# Altium project PCB_FinalProject.PrjPcb
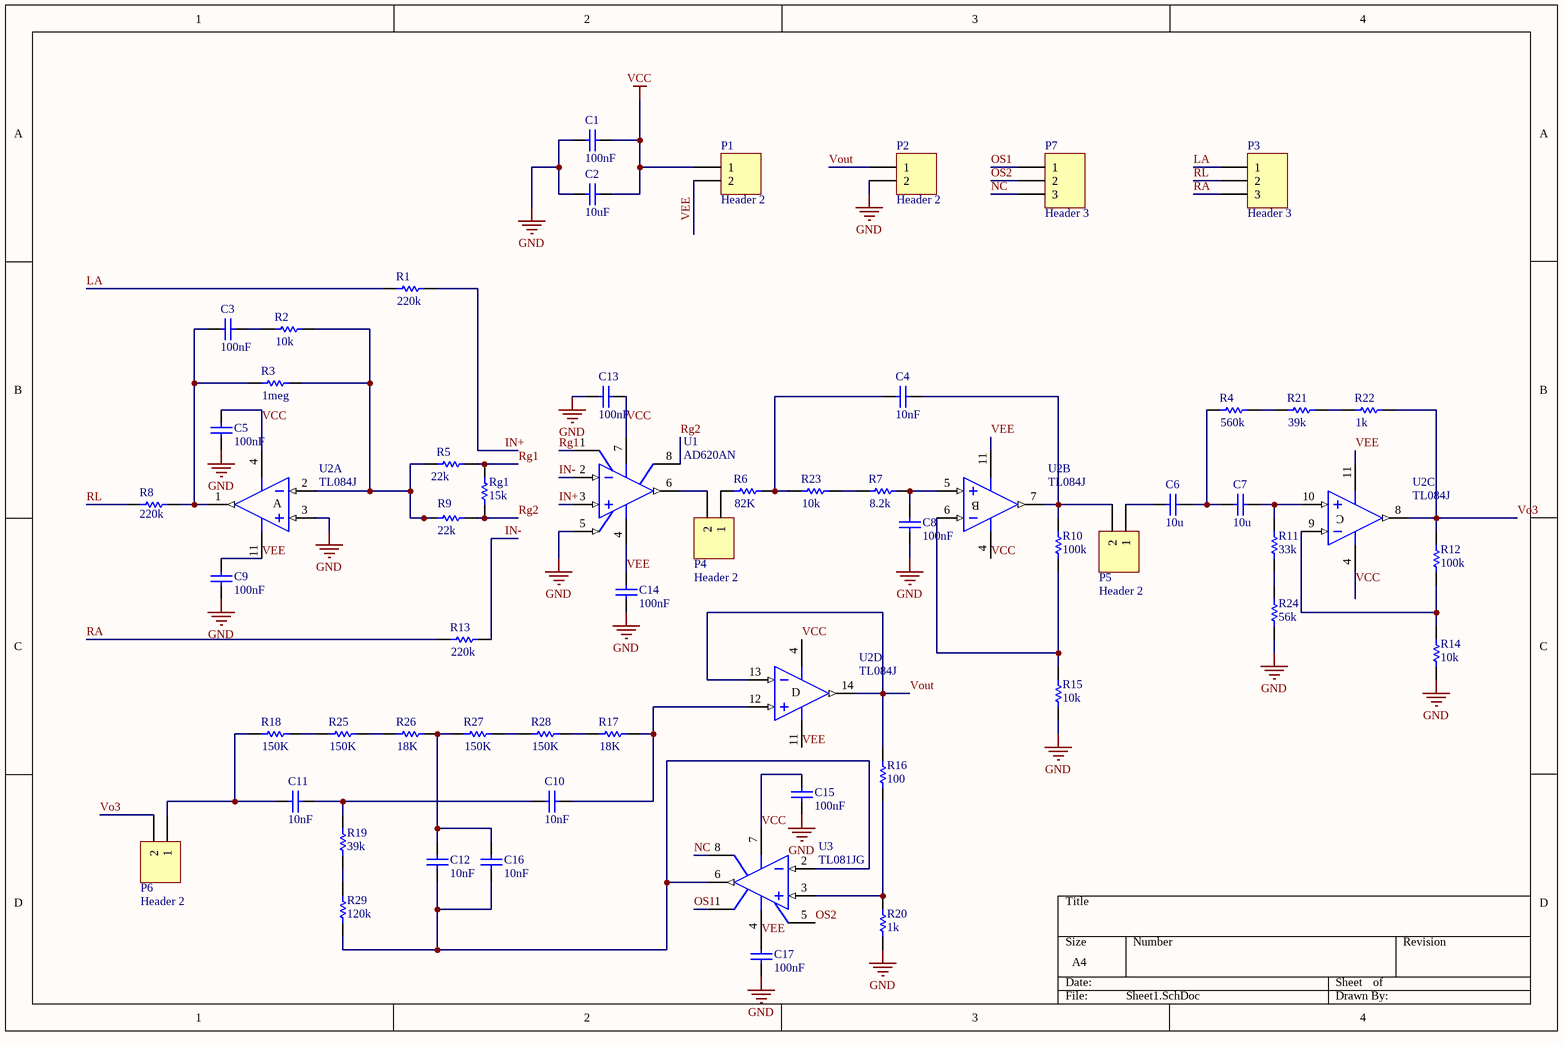
[diagram p0: Sheet1.SchDoc]
1 sheet, 57 parts. Net scope: global (net labels, ports and power ports of the same name join across sheets).
Board file: PCB1.PcbDoc

## Sheet Sheet1.SchDoc
size A4; SheetNumber: 1; SheetTotal: 1; SPICEModelCacheBJFJUIVT: <root> / <DocumentId>BJFJUIVT</DocumentId> / <CacheFrame Number="0"> / <Model Name="ad620a" Kind="CKT"> / <Text>* AD620A SPICE Macro-model              10/95, Rev. B / *                                       ARG / ADSC / * / * This version of the AD620 model simulates the worst-case / * parameters of the 'A' grade. The worst-case parameters / * used correspond to those in the data sheet. / * / * / * Revision History: / *     Rev. B / * Added V2,V3,V12,V13 and D3,D4,D15,D16 to clamp inputs to Q3,Q4 to / * prevent output phase reversal. / * / * / * Copyright 1990 by Analog Devices, Inc. / * / * Refer to "README.DOC" file for License Statement. Use of this model / * indicates your acceptance with the terms and provisions in the License / * Statement. / * / * Node assignments / *                 non-inverting input / *                 |  inverting input / *                 |  |  positive supply / *                 |  |  |  negative supply / *                 |  |  |  |  output / *                 |  |  |  |  |  ref / *                 |  |  |  |  |  |  rg1 / *                 |  |  |  |  |  |  |  rg2 / *                 |  |  |  |  |  |  |  | / .SUBCKT AD620A    1  2  99 50 46 20 7  8 / * / * INPUT STAGE / * / I1   7    50   5.002E-6 / I2   8    50   5.002E-6 / IOS  3    4    0.5E-9 / VIOS 21   3    125E-6 / CCM  3    4    2E-12 / CD1  3    0    2E-12 / CD2  4    0    2E-12 / Q1   5    4    7    QN1 / Q2   6    21   8    QN1 / D1   7    4    DX / D2   8    21   DX / R1   1    3    400 / R2   2    4    400 / R3   99   5    100E3 / R4   99   6    100E3 / R5   7    9    24.7E3 / R6   8    10   24.7E3 / E1   9    46   11 5 375E6 / E2   10   46   11 6 375E6 / V1   99   11   0.5 / RV1  99   11   1E3 / CC1  5    9    4E-12 / CC2  6    10   4E-12 / * / * DIFFERENCE AMPLIFIER AND POLE AT 1MHZ / * / I3   18   50   5E-6 / R7   99   12   11.937E3 / R8   99   15   11.937E3 / R9   14   18   1.592E3 / R10  17   18   1.592E3 / R11  9    13   10E3 / R12  13   46   10E3 / Q3   12   13   14   QN2 / Q4   15   16   17   QN2 / R13  19   16   10E3 / R14  16   20   10E3 / C1   12   15   6.667E-12 / EOOS 19   10   POLY(1) (38,98) 1.5E-3 223.872 / EREF 98   0    POLY(2) (99,0) (50,0) 0 0.5 0.5 / D3 13 51 DX / D4 16 52 DX / V2 99 51 0.7 / V3 99 52 0.7 / D15 53 13 DX / D16 54 16 DX / V12 53 50 0.7 / V13 54 50 0.7 / * / * GAIN STAGE AND DOMINANT POLE AT 0.667HZ / * / R16  25   98   35.810E9 / C2   25   98   6.667E-12 / G1   98   25   12 15 83.776E-6 / V6   99   26   1.53 / V7   27   50   1.33 / D7   25   26   DX / D8   27   25   DX / * / * POLE AT 10MHZ / * / R17  40   98   1 / C3   40   98   15.916E-9 / G2   98   40   25 98 1 / * / * COMMON MODE STAGE WITH ZERO AT 708HZ / * / E3   36   98   POLY(2) (1,98) (2,98) 0 0.5 0.5 / R18  36   38   1E6 / R19  38   98   1 / C5   36   38   224.812E-12 / * / * OUTPUT STAGE / * / GSY  99   50   POLY(1) (99,50) 1.1725E-3 3.125E-6 / RO1  99   45   250 / RO2  45   50   250 / L1   45   46   1E-6 / GO1  45   99   99 40 4E-3 / GO2  50   45   40 50 4E-3 / GC1  43   50   40 45 4E-3 / GC2  44   50   45 40 4E-3 / F1   45   0    V4 1 / F2   0    45   V5 1 / V4   41   45   1.65 / V5   45   42   1.65 / D9   50   43   DY / D10  50   44   DY / D11  99   43   DX / D12  99   44   DX / D13  40   41   DX / D14  42   40   DX / * / * MODELS USED / * / .MODEL DX D(IS=1E-12) / .MODEL DY D(IS=1E-12 BV=50) / .MODEL QN1 NPN(BF=2.5E3 KF=0.7E-15 AF=1) / .MODEL QN2 NPN(BF=250 KF=0.5E-14 AF=1) / .ENDS AD620A</Text> / </Model> / <Model Name="cap" Kind="MDL"> / <Text>*Default semiconductor capacitor / .MODEL CAP C()</Text> / </Model> / <Model Name="tl081" Kind="CKT"> / <Text>*TL081 / *Sngl WideBW JFETInput OpAmp pkg:DIP8 3,2,7,4,6. / * Connections: / *             Non-Inverting Input / *             |   Inverting Input / *             |   |   Positive Power Supply / *             |   |   |   Negative Power Supply / *             |   |   |   |   Output / *             |   |   |   |   | / .SUBCKT TL081 1   2   3   4   5 / C1   11 12 3.498E-12 / C2    6  7 15E-12 / DC    5 53 DX / DE   54  5 DX / DLP  90 91 DX / DLN  92 90 DX / DP    4  3 DX / BGND 99  0 V=V(3)*.5 + V(4)*.5 / BB    7 99 I=I(VB)*4.715E6 - I(VC)*5E6 + I(VE)*5E6 + / +              I(VLP)*5E6 - I(VLN)*5E6 / GA    6  0 11 12 282.8E-6 / GCM   0  6 10 99 8.942E-9 / ISS   3 10 DC 195E-6 / HLIM 90  0 VLIM 1K / J1   11  2 10 JX / J2   12  1 10 JX / R2    6  9 100E3 / RD1   4 11 3.536E3 / RD2   4 12 3.536E3 / RO1   8  5 150 / RO2   7 99 150 / RP    3  4 2.143E3 / RSS  10 99 1.026E6 / VB    9  0 DC 0 / VC    3 53 DC 2.2 / VE   54  4 DC 2.2 / VLIM  7  8 DC 0 / VLP  91  0 DC 25 / VLN   0 92 DC 25 / .MODEL DX D(IS=800E-18) / .MODEL JX PJF(IS=15E-12 BETA=270.1E-6 VTO=-1) / .ENDS TL081</Text> / </Model> / <Model Name="tl084" Kind="CKT"> / <Text>*TL084 / *Quad JFETInput OpAmp pkg:DIP14 (A:3,2,4,11,1)(B:5,6,4,11,7)(C:10,9,4,11,8)(D:12,13,4,11,14) / * Connections: / *             Non-Inverting Input / *             |   Inverting Input / *             |   |   Positive Power Supply / *             |   |   |   Negative Power Supply / *             |   |   |   |   Output / *             |   |   |   |   | / .SUBCKT TL084 1   2   3   4   5 / C1   11 12 3.498E-12 / C2    6  7 15E-12 / DC    5 53 DX / DE   54  5 DX / DLP  90 91 DX / DLN  92 90 DX / DP    4  3 DX / BGND 99  0 V=V(3)*.5 + V(4)*.5 / BB    7 99 I=I(VB)*4.715E6 - I(VC)*5E6 + I(VE)*5E6 + / +              I(VLP)*5E6 - I(VLN)*5E6 / GA    6  0 11 12 282.8E-6 / GCM   0  6 10 99 8.942E-9 / ISS   3 10 DC 195E-6 / HLIM 90  0 VLIM 1K / J1   11  2 10 JX / J2   12  1 10 JX / R2    6  9 100E3 / RD1   4 11 3.536E3 / RD2   4 12 3.536E3 / RO1   8  5 150 / RO2   7 99 150 / RP    3  4 2.143E3 / RSS  10 99 1.026E6 / VB    9  0 DC 0 / VC    3 53 DC 2.2 / VE   54  4 DC 2.2 / VLIM  7  8 DC 0 / VLP  91  0 DC 25 / VLN   0 92 DC 25 / .MODEL DX D(IS=800E-18) / .MODEL JX PJF(IS=15E-12 BETA=270.1E-6 VTO=-1) / .ENDS TL084</Text> / </Model> / </CacheFrame> / </root>

### Parts
C1  100nF  [RAD-0.3]
C2  10uF  [RAD-0.3]
C3  100nF  [RAD-0.3]
C4  value 10nF  [RAD-0.3]  (hidden comment: Cap)
C5  value 100nF  [RAD-0.3]  (hidden comment: Cap)
C6  value 10u  [RAD-0.3]  (hidden comment: Cap)
C7  value 10u  [RAD-0.3]  (hidden comment: Cap)
C8  value 100nF  [RAD-0.3]  (hidden comment: Cap)
C9  value 100nF  [RAD-0.3]  (hidden comment: Cap)
C10  value 10nF  [RAD-0.3]  (hidden comment: Cap)
C11  value 10nF  [RAD-0.3]  (hidden comment: Cap)
C12  value 10nF  [RAD-0.3]  (hidden comment: Cap)
C13  100nF  [RAD-0.3]
C14  value 100nF  [RAD-0.3]  (hidden comment: Cap)
C15  value 100nF  [RAD-0.3]  (hidden comment: Cap)
C16  value 10nF  [RAD-0.3]  (hidden comment: Cap)
C17  value 100nF  [RAD-0.3]  (hidden comment: Cap)
P1  Header 2  [HDR1X2]
P2  Header 2  [HDR1X2]
P3  Header 3  [HDR1X3]
P4  Header 2  [HDR1X2]
P5  Header 2  [HDR1X2]
P6  Header 2  [HDR1X2]
P7  Header 3  [HDR1X3]
R1  value 220k  [AXIAL-0.3]  (hidden comment: Res1)
R2  value 10k  [AXIAL-0.3]  (hidden comment: Res1)
R3  value 1meg  [AXIAL-0.3]  (hidden comment: Res1)
R4  value 560k  [AXIAL-0.3]  (hidden comment: Res1)
R5  value 22k  [AXIAL-0.3]  (hidden comment: Res1)
R6  value 82K  [AXIAL-0.3]  (hidden comment: Res1)
R7  value 8.2k  [AXIAL-0.3]  (hidden comment: Res1)
R8  value 220k  [AXIAL-0.3]  (hidden comment: Res1)
R9  value 22k  [AXIAL-0.3]  (hidden comment: Res1)
R10  value 100k  [AXIAL-0.3]  (hidden comment: Res1)
R11  value 33k  [AXIAL-0.3]  (hidden comment: Res1)
R12  value 100k  [AXIAL-0.3]  (hidden comment: Res1)
R13  value 220k  [AXIAL-0.3]  (hidden comment: Res1)
R14  value 10k  [AXIAL-0.3]  (hidden comment: Res1)
R15  value 10k  [AXIAL-0.3]  (hidden comment: Res1)
R16  value 100  [AXIAL-0.3]  (hidden comment: Res1)
R17  value 18K  [AXIAL-0.3]  (hidden comment: Res1)
R18  value 150K  [AXIAL-0.3]  (hidden comment: Res1)
R19  value 39k  [AXIAL-0.3]  (hidden comment: Res1)
R20  value 1k  [AXIAL-0.3]  (hidden comment: Res1)
R21  value 39k  [AXIAL-0.3]  (hidden comment: Res1)
R22  value 1k  [AXIAL-0.3]  (hidden comment: Res1)
R23  value 10k  [AXIAL-0.3]  (hidden comment: Res1)
R24  value 56k  [AXIAL-0.3]  (hidden comment: Res1)
R25  value 150K  [AXIAL-0.3]  (hidden comment: Res1)
R26  value 18K  [AXIAL-0.3]  (hidden comment: Res1)
R27  value 150K  [AXIAL-0.3]  (hidden comment: Res1)
R28  value 150K  [AXIAL-0.3]  (hidden comment: Res1)
R29  value 120k  [AXIAL-0.3]  (hidden comment: Res1)
Rg1  value 15k  [AXIAL-0.3]  (hidden comment: Res1)
U1  AD620AN  [N-8]
U2  TL084J  [J014]  (parts A,B,C,D of 4)
U3  TL081JG  [JG008]

### Nets
GND: C1.1 C2.1 C5.1 C8.1 C9.1 C13.1 C14.1 C15.1 C17.1 P2.2 R14.1 R15.1 R20.1 R24.1 U1.5(REF) U2.3(IN+)
VCC: C1.2 C2.2 C5.2 C13.2 C15.2 P1.1 U1.7(V+) U2.4(V+) U3.7(V+)
IN+: R1.2 U1.3(+IN)
IN-: R13.2 U1.2(-IN)
LA: P3.1 R1.1
NC: P7.3 U3.8(NC)
OS1: P7.1 U3.1(OS_TRIM)
OS2: P7.2 U3.5(OS_TRIM)
RA: P3.3 R13.1
Rg1: R5.2 Rg1.2 U1.1(RG)
Rg2: R9.2 Rg1.1 U1.8(RG)
RL: P3.2 R8.2
VEE: C9.2 C14.2 C17.2 P1.2 U1.4(V-) U2.11(V-) U3.4(V-)
Vo3: P6.2 R12.2 R22.2 U2.8(OUT)
Vout: P2.1 R16.2 U2.13(IN-) U2.14(OUT)
NetC3_1: C3.1 R3.1 R8.1 U2.1(OUT)
NetC3_2: C3.2 R2.1
NetC4_1: C4.1 P5.2 R10.2 U2.7(OUT)
NetC4_2: C4.2 R6.2 R23.1
NetC6_1: C6.1 C7.2 R4.1
NetC6_2: C6.2 P5.1
NetC7_1: C7.1 R11.2 U2.10(IN+)
NetC8_2: C8.2 R7.2 U2.5(IN+)
NetC10_1: C10.1 R17.2 U2.12(IN+)
NetC10_2: C10.2 C11.1 R19.2
NetC11_2: C11.2 P6.1 R18.1
NetC12_1: C12.1 C16.1 R26.2 R27.1
NetC12_2: C12.2 C16.2 R29.1 U3.2(IN-) U3.6(OUT)
NetP4_1: P4.1 R6.1
NetP4_2: P4.2 U1.6(OUT)
NetR2_2: R2.2 R3.2 R5.1 R9.1 U2.2(IN-)
NetR4_2: R4.2 R21.1
NetR7_1: R7.1 R23.2
NetR10_1: R10.1 R15.2 U2.6(IN-)
NetR11_1: R11.1 R24.2
NetR12_1: R12.1 R14.2 U2.9(IN-)
NetR16_1: R16.1 R20.2 U3.3(IN+)
NetR17_1: R17.1 R28.2
NetR18_2: R18.2 R25.1
NetR19_1: R19.1 R29.2
NetR21_2: R21.2 R22.1
NetR25_2: R25.2 R26.1
NetR27_2: R27.2 R28.1

### Notes on the sheet
- (in symbol TL084J, part A) A
- (in symbol TL084J, part B) B
- (in symbol TL084J, part C) C
- (in symbol TL084J, part D) D

### Library data of the parts
C1-C17 = Cap: Capacitor; Published: 8-Jun-2000; LatestRevisionDate: 17-Jul-2002; LatestRevisionNote: Re-released for DXP Platform.; PackageReference: RAD-0.3; Publisher: Altium Limited; PackageDescription: Radial Cap, Thru-Hole; 2 Leads; 0.3 in Pin Spacing
P1 P2 P4-P6 = Header 2: Header, 2-Pin; LatestRevisionDate: 17-Jul-2002; LatestRevisionNote: Re-released for DXP Platform.; Publisher: Altium Limited
P3 P7 = Header 3: Header, 3-Pin; LatestRevisionDate: 17-Jul-2002; LatestRevisionNote: Re-released for DXP Platform.; Publisher: Altium Limited
R1-R29 Rg1 = Res1: Resistor; Published: 8-Jun-2000; LatestRevisionDate: 17-Jul-2002; LatestRevisionNote: Re-released for DXP Platform.; PackageReference: AXIAL-0.3; Publisher: Altium Limited; PackageDescription: Axial Device, Thru-Hole; 2 Leads; 0.3 in Pin Spacing
U1 = AD620AN: Low-Cost, Low-Power Instrumentation Amplifier; Published: 8-Jun-2000; LatestRevisionDate: 04-Mar-2005; LatestRevisionNote: Stylized 3D Model Added.; DatasheetVersion: REV.D 1998; PackageVersion: revA; PackageReference: N-8; Publisher: Altium Limited; PackageDescription: DIP; 8 Leads; Row Spacing 7.62 mm; Pitch 2.54 mm; ComponentLink1Description: Manufacturer Link; ComponentLink1URL: http://www.analog.com/en/prod/0%2C2877%2CAD620%2C00.html; ComponentLink2Description: Datasheet; ComponentLink2URL: http://www.analog.com/UploadedFiles/Data_Sheets/897653854AD620_g.pdf
U2 = TL084J: JFET-Input Operational Amplifier; Published: 16-Jan-2001; LatestRevisionDate: 04-Mar-2005; LatestRevisionNote: Stylized 3D Model Added.; DatasheetVersion: Feb-1999; PackageVersion: Jun-1999; PackageReference: J014; Publisher: Altium Limited; PackageDescription: DIP; 14 Leads; Row Spacing 7.62 mm; Pitch 2.54 mm; ComponentLink1Description: Manufacturer Link; ComponentLink1URL: http://www.ti.com/; ComponentLink2Description: Datasheet; ComponentLink2URL: http://www-s.ti.com/sc/ds/tl084.pdf
U3 = TL081JG: JFET-Input Operational Amplifier; Note: Pin 8 is not connected; Published: 16-Jan-2001; LatestRevisionDate: 04-Mar-2005; LatestRevisionNote: Stylized 3D Model Added.; DatasheetVersion: Feb-1999; PackageVersion: Jan-1995; PackageReference: JG008; Publisher: Altium Limited; PackageDescription: DIP; 8 Leads; Row Spacing 7.62 mm; Pitch 2.54 mm; ComponentLink1Description: Manufacturer Link; ComponentLink1URL: http://www.ti.com/; ComponentLink2Description: Datasheet; ComponentLink2URL: http://www-s.ti.com/sc/ds/tl081.pdf